# EAGLE design Frequency-Counter-v11 (EAGLE 5.04)
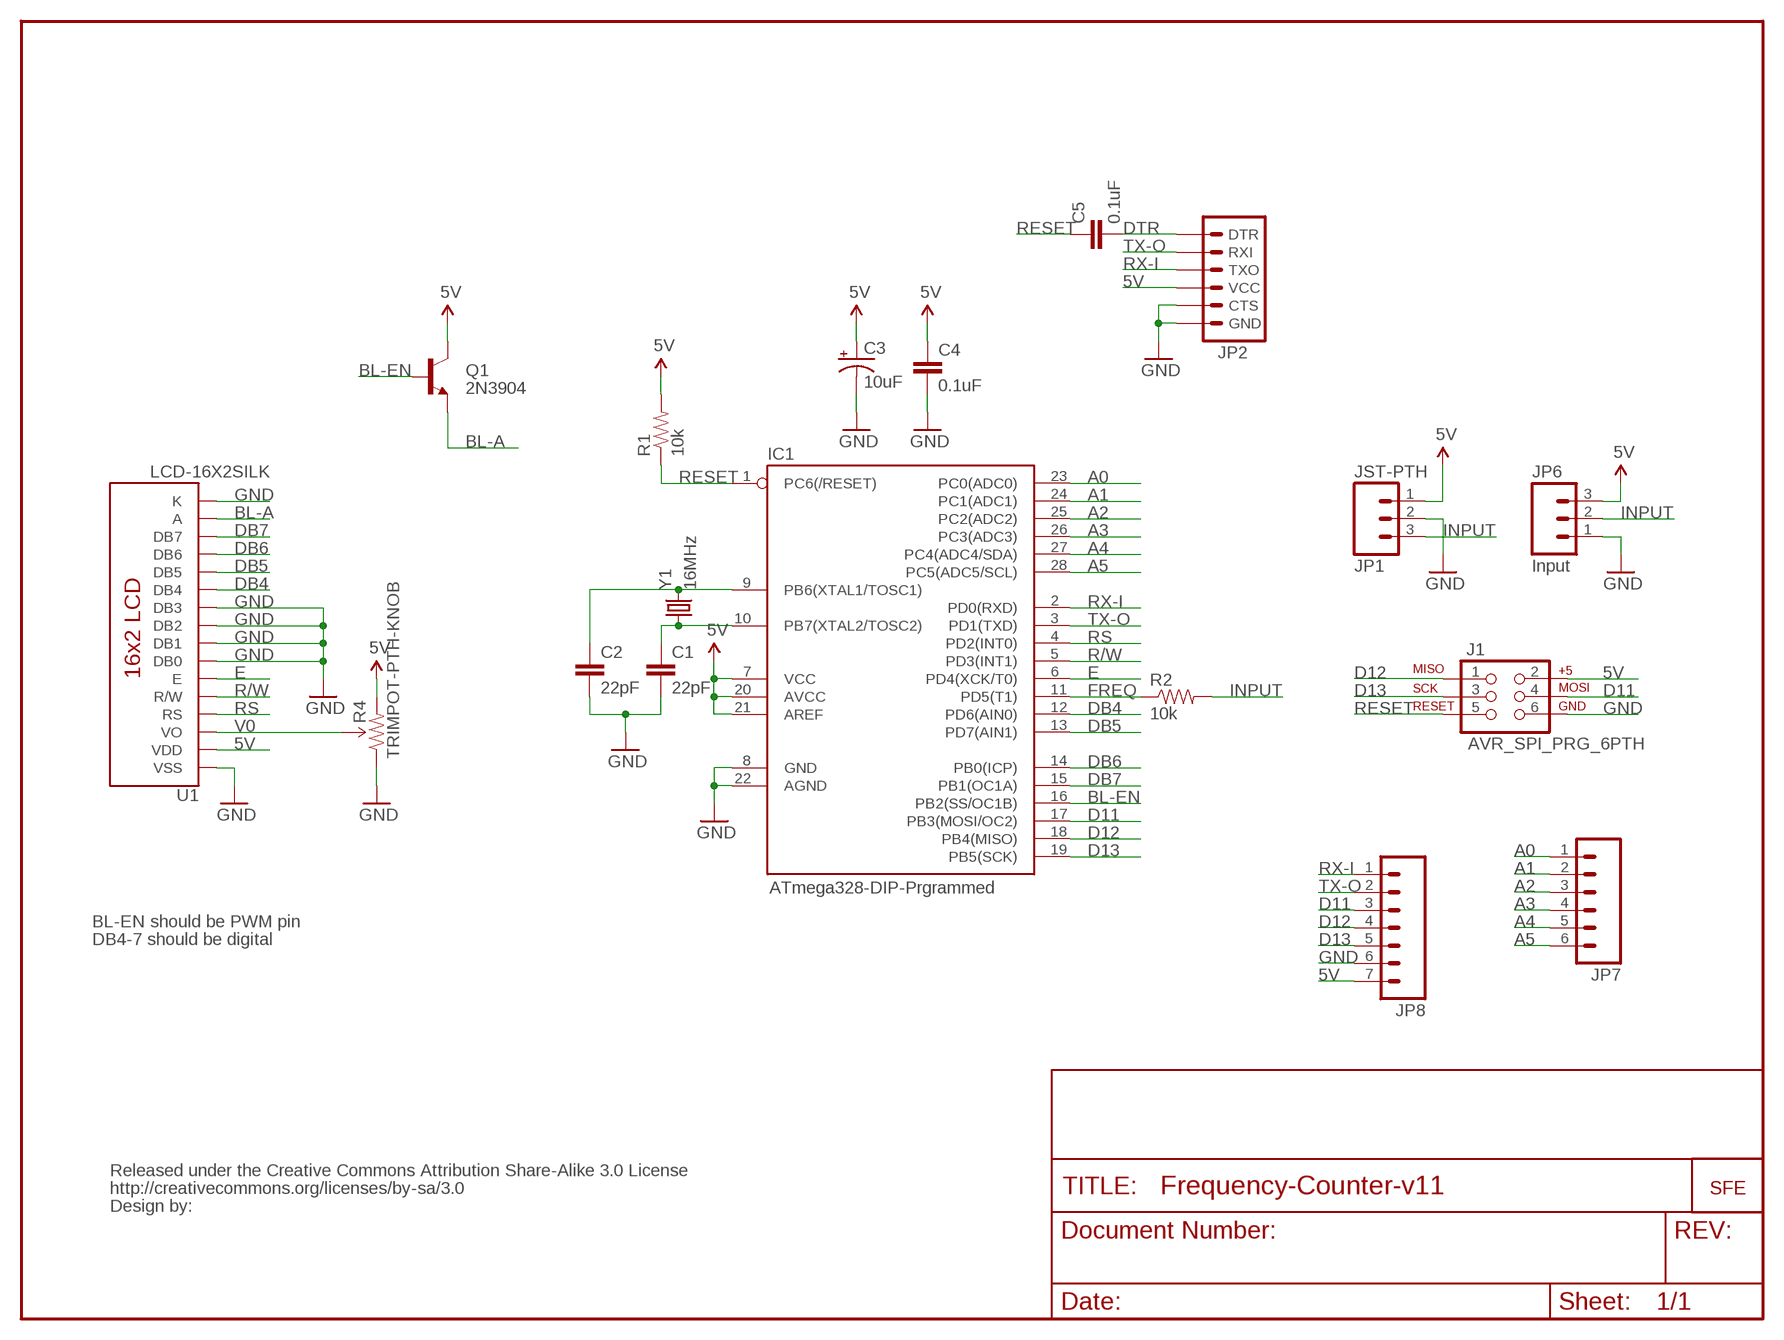
[diagram p0: schematic, sheet 1]

## Parts
C1  22pF  CAPPTH2  [CAP-PTH-SMALL2]
C2  22pF  CAPPTH2  [CAP-PTH-SMALL2]
C3  10uF  CAP_POLPTH2  [CPOL-RADIAL-10UF-25V]
C4  0.1uF  CAPPTH2  [CAP-PTH-SMALL2]
C5  0.1uF  CAPPTH2  [CAP-PTH-SMALL2]
IC1  ATmega328-DIP-Prgrammed  AVR-MEGA8-PPTH  [DIL28-3]
J1  AVR_SPI_PRG_6PTH  [2X3]
JP1  JST-PTH  M03JST-PTH  [JST-3-PTH]
JP2  ARDUINO_SERIAL_PROGRAMPTH  [1X06]
JP3  LOGO-SFENEW  [SFE-NEW-WEBLOGO]
JP6  Input  M03PTH  [1X03]
JP7  M06SIP  [1X06]
JP8  M07  [1X07]
Q1  2N3904  TRANSISTOR_NPNTO92  [TO-92]
R1  10k  RESISTORAXIAL-0.3  [AXIAL-0.3]
R2  10k  RESISTORAXIAL-0.3  [AXIAL-0.3]
R4  TRIMPOT-PTH-KNOB  [3386U]
U1  LCD-16X2SILK  [LCD-16X2]
U$4  CREATIVE_COMMONS  [CREATIVE_COMMONS]
Y1  16MHz  CRYSTALHC49US  [HC49US]

## Nets
5V: C3.1(+) C4.1 IC1.7(VCC) IC1.20(AVCC) IC1.21(AREF) J1.2 JP1.1 JP2.4(VCC) JP6.3 JP8.7 Q1.3(C) R1.P$2 R4.3(CW) U1.2(VDD)
A0: IC1.23(PC0(ADC0)) JP7.1
A1: IC1.24(PC1(ADC1)) JP7.2
A2: IC1.25(PC2(ADC2)) JP7.3
A3: IC1.26(PC3(ADC3)) JP7.4
A4: IC1.27(PC4(ADC4/SDA)) JP7.5
A5: IC1.28(PC5(ADC5/SCL)) JP7.6
BL-A: Q1.1(E) U1.15(A)
BL-EN: IC1.16(PB2(SS/OC1B)) Q1.2(B)
D11: IC1.17(PB3(MOSI/OC2)) J1.4 JP8.3
D12: IC1.18(PB4(MISO)) J1.1 JP8.4
D13: IC1.19(PB5(SCK)) J1.3 JP8.5
DB4: IC1.12(PD6(AIN0)) U1.11(DB4)
DB5: IC1.13(PD7(AIN1)) U1.12(DB5)
DB6: IC1.14(PB0(ICP)) U1.13(DB6)
DB7: IC1.15(PB1(OC1A)) U1.14(DB7)
DTR: C5.2 JP2.1(DTR)
E: IC1.6(PD4(XCK/T0)) U1.6(E)
FREQ: IC1.11(PD5(T1)) R2.P$1
GND: C1.2 C2.2 C3.2(-) C4.2 IC1.8(GND) IC1.22(AGND) J1.6 JP1.2 JP2.5(CTS) JP2.6(GND) JP6.1 JP8.6 R4.1(CCW) U1.1(VSS) U1.7(DB0) U1.8(DB1) U1.9(DB2) U1.10(DB3) U1.16(K)
INPUT: JP1.3 JP6.2 R2.P$2
R/W: IC1.5(PD3(INT1)) U1.5(R/W)
RESET: C5.1 IC1.1(PC6(/RESET)) J1.5 R1.P$1
RS: IC1.4(PD2(INT0)) U1.4(RS)
RX-I: IC1.2(PD0(RXD)) JP2.3(TXO) JP8.1
TX-O: IC1.3(PD1(TXD)) JP2.2(RXI) JP8.2
V0: R4.2(WIPER) U1.3(VO)
XTAL1: C2.1 IC1.9(PB6(XTAL1/TOSC1)) Y1.2
XTAL2: C1.1 IC1.10(PB7(XTAL2/TOSC2)) Y1.1

## Notes on the sheet
- BL-EN should be PWM pin
- DB4-7 should be digital

## Library data of the parts
C1 C2 C4 C5 = SparkFun:CAP: Capacitor Standard 0603 ceramic capacitor, and 0.1" leaded capacitor.
C3 = SparkFun:CAP_POL: Capacitor Polarized These are standard SMD and PTH capacitors. Normally 10uF, 47uF, and 100uF in electrolytic and tantalum varieties. Always verify the external diameter of the through hole cap, it varies with capacity, voltage, and manufacturer. The EIA devices should be standard.
IC1 = SparkFun:AVR-MEGA8-P: MICROCONTROLLER 8 Kbytes FLASH 1 kbytes SRAM 512 bytes EEPROM USART 4-channel 10 bit ADC 2-channel 8 bit ADC
J1 = SparkFun:AVR_SPI_PRG_6: AVR ISP 6 Pin This is the reduced ISP connector for AVR programming. Common on Arduino. This footprint will take up less PCB space and can be used with a 10-pin to 6-pin adapter such as SKU: BOB-08508
JP1 JP6 = SparkFun:M03: Header 3 Standard 3-pin 0.1" header. Use with straight break away headers (SKU : PRT-00116), right angle break away headers (PRT-00553), swiss pins (PRT-00743), machine pins (PRT-00117), and female headers (PRT-00115). Molex polarized connector foot print use with SKU : PRT-08232 with associated crimp pins and housings.
JP2 = SparkFun:ARDUINO_SERIAL_PROGRAM
JP3 = SparkFun:LOGO-SFE: Spark Fun Electronics PCB Logo This is the standard Spark Fun Electronics PCB logo.
JP7 = SparkFun:M06: Header 6 Standard 6-pin 0.1" header. Use with straight break away headers (SKU : PRT-00116), right angle break away headers (PRT-00553), swiss pins (PRT-00743), machine pins (PRT-00117), and female headers (PRT-00115). Molex polarized connector foot print use with SKU : PRT-08094 with associated crimp pins and housings. NOTES ON THE VARIANTS LOCK and LOCK_LONGPADS... This footprint was designed to help hold the alignment of a through-hole component (i.e. 6-pin header) while soldering it into place. You may notice that each hole has been shifted either up or down by 0.005 of an inch from it's more standard position (which is a perfectly straight line). This slight alteration caused the pins (the squares in the middle) to touch the edges of the holes. Because they are alternating, it causes a "brace" to hold the component in place. 0.005 has proven to be the perfect amount of "off-center" position when using our standard breakaway headers. Although looks a little odd when you look at the bare footprint, once you have a header in there, the alteration is very hard to notice. Also, if you push a header all the way into place, it is covered up entirely on the bottom side. This idea of altering the position of holes to aid alignment will be further integrated into the Sparkfun Library for other footprints. It can help hold any component with 3 or more connection pins.
JP8 = SparkFun:M07: Header 7 Standard 7-pin 0.1" header. Use with straight break away headers (SKU : PRT-00116), right angle break away headers (PRT-00553), swiss pins (PRT-00743), machine pins (PRT-00117), and female headers (PRT-00115). NOTES ON THE VARIANTS LOCK and LOCK_LONGPADS... This footprint was designed to help hold the alignment of a through-hole component (i.e. 7-pin header) while soldering it into place. You may notice that each hole has been shifted either up or down by 0.005 of an inch from it's more standard position (which is usually a perfectly straight line). This slight alteration caused the pins (the squares in the middle) to touch the edges of the holes. Because they are alternating, it causes a "brace" to hold the header in place. 0.005 has proven to be the perfect amount of "off-center" position when using our standard breakaway headers. Although looks a little odd when you look at the bare footprint, once you have a header in there, the alteration is very hard to notice. Also, if you push a header all the way into place, it is covered up entirely on the bottom side. This idea of altering the position of holes to aid alignment will be further integrated into the Sparkfun Library for other footprints. It can help hold any component with 3 or more connection pins.
Q1 = SparkFun:TRANSISTOR_NPN: Transistor NPN BJT configuration in SOT23 package. MMBT2222 is the common NPN we use. Double check BCE configuration again layout.
R1 R2 = SparkFun:RESISTOR: Resistor Basic schematic elements and footprints for 0603, 1206, and PTH resistors.
R4 = SparkFun:TRIMPOT
U1 = SparkFun:LCD-16X2
U$4 = SparkFun:CREATIVE_COMMONS
Y1 = SparkFun:CRYSTAL: Crystals Various standard crystals. Proven footprints. Spark Fun Electronics SKU : COM-00534

## Board
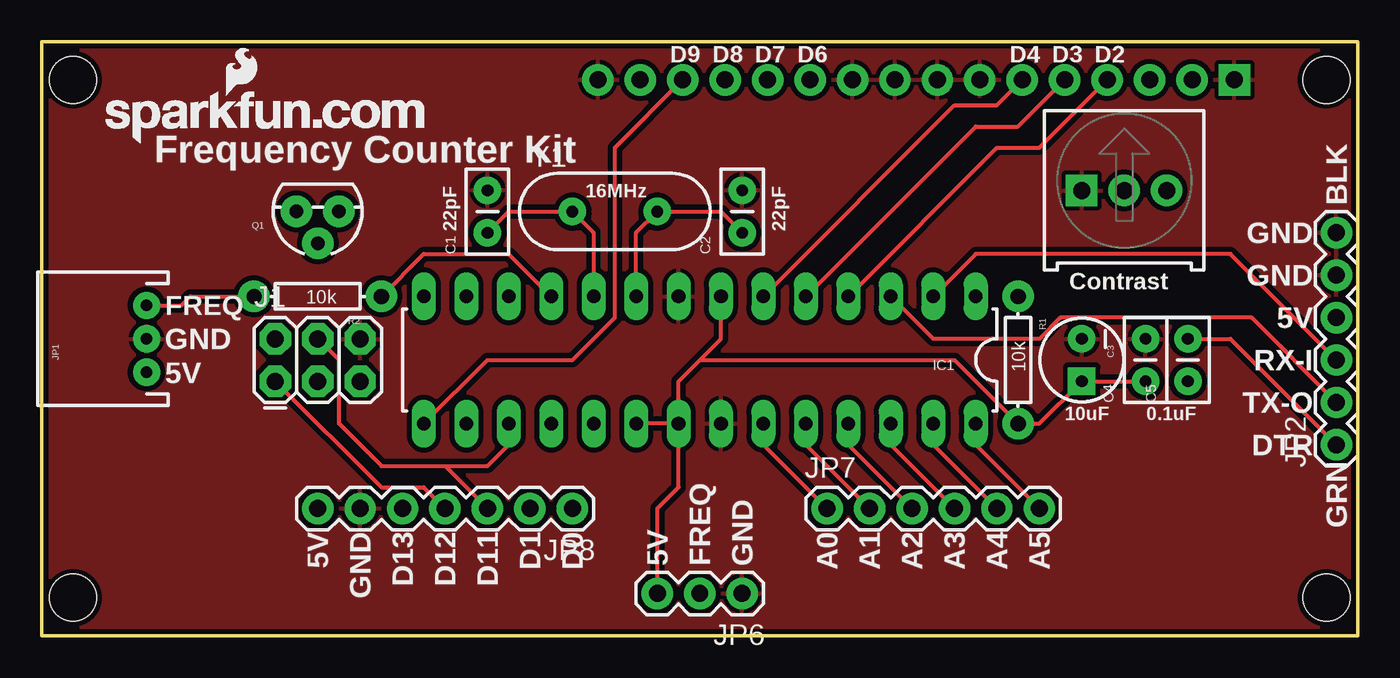
[diagram p1: board, top side]
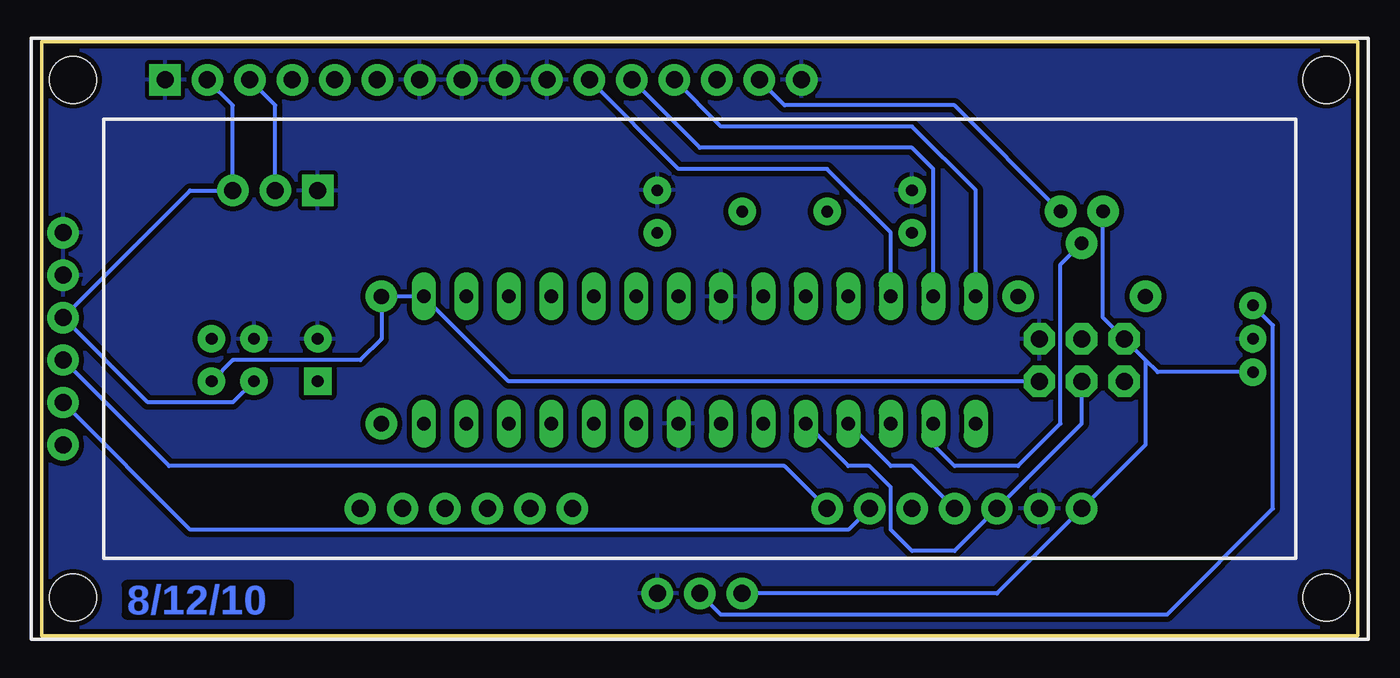
[diagram p2: board, bottom side, seen from below]

Size 78.74 x 35.56 mm. Coordinates in mm from the lower left corner, seen from the top.
Outline: 78.74,0 78.74,35.56 0,35.56 0,0 78.74,0
Copper layers (1*16): Top 0.035mm / dielectric 1.5mm / Bottom 0.035mm
Design rules "SparkFun": minimum track width 8mil, minimum drill 20mil, track to track 8mil, track to pad 8mil, pad to pad 8mil, via to via 8mil, smd to smd 8mil, copper to edge 8mil, drill to drill 8mil, minimum pad ring 12mil, minimum via ring 10mil, stop-mask expansion 4mil, vias tented up to drill 20mil, thermal gap 10mil

### Footprints (pad centres in the part's own frame; a part is rotated, then mirrored left to right if it is on the bottom)
CAP-PTH-SMALL2 = drill 0.7 pad 1.651 round: 1 0,0; 2 2.54,0
CPOL-RADIAL-10UF-25V = drill 0.7 pad 1.651 square: 1 1.27,0 | drill 0.7 pad 1.651 round: 2 -1.27,0
DIL28-3 = drill 0.813 long: 1 -16.51,-3.81; 2 -13.97,-3.81; 3 -11.43,-3.81; 4 -8.89,-3.81; 5 -6.35,-3.81; 6 -3.81,-3.81; 7 -1.27,-3.81; 8 1.27,-3.81; 9 3.81,-3.81; 10 6.35,-3.81; 11 8.89,-3.81; 12 11.43,-3.81; 13 13.97,-3.81; 14 16.51,-3.81; 15 16.51,3.81; 16 13.97,3.81; 17 11.43,3.81; 18 8.89,3.81; 19 6.35,3.81; 20 3.81,3.81; 21 1.27,3.81; 22 -1.27,3.81; 23 -3.81,3.81; 24 -6.35,3.81; 25 -8.89,3.81; 26 -11.43,3.81; 27 -13.97,3.81; 28 -16.51,3.81
2X3 = drill 1.016 pad 1.88 octagon: 1 0,0; 2 0,2.54; 3 2.54,0; 4 2.54,2.54; 5 5.08,0; 6 5.08,2.54
JST-3-PTH = drill 0.7 pad 1.626 round: 1 -2,-5; 2 0,-5; 3 2,-5
1X06 = drill 1.016 pad 1.88 round: 1 0,0; 2 2.54,0; 3 5.08,0; 4 7.62,0; 5 10.16,0; 6 12.7,0
1X03 = drill 1.016 pad 1.88 round: 1 0,0; 2 2.54,0; 3 5.08,0
1X07 = drill 1.016 pad 1.88 round: 1 0,0; 2 2.54,0; 3 5.08,0; 4 7.62,0; 5 10.16,0; 6 12.7,0; 7 15.24,0
TO-92 = drill 0.813 pad 1.88 round: 1 -1.27,0; 2 0,1.905; 3 1.27,0
AXIAL-0.3 = drill 0.9 pad 1.88 round: P$1 -3.81,0; P$2 3.81,0
3386U = drill 1.016 pad 1.88 square: 1 -2.54,-0.015 | drill 1.016 pad 1.88 round: 2 0,-0.015; 3 2.54,-0.015
LCD-16X2 = drill 1.016 pad 1.88 square: 1 -32,15.5 | drill 1.016 pad 1.88 round: 2 -29.46,15.5; 3 -26.92,15.5; 4 -24.38,15.5; 5 -21.84,15.5; 6 -19.3,15.5; 7 -16.76,15.5; 8 -14.22,15.5; 9 -11.68,15.5; 10 -9.14,15.5; 11 -6.6,15.5; 12 -4.06,15.5; 13 -1.52,15.5; 14 1.02,15.5; 15 3.56,15.5; 16 6.1,15.5 | hole 2.8: -37.5,15.5; -37.5,-15.5; 37.5,15.5; 37.5,-15.5
HC49US = drill 0.7 pad 1.651 round: 1 -2.54,0; 2 2.54,0

### Placement (x,y rotation side)
C1  26.67,24.13 90 top
C2  41.91,24.13 90 top
C3  62.23,16.51 270 top
C4  66.04,15.24 90 top
C5  68.58,15.24 90 top
IC1  39.37,16.51 180 top
J1  13.97,15.24 0 top
JP1  1.27,17.78 90 top
JP2  77.47,11.43 90 top
JP3  3.81,29.46 0 top
JP6  41.91,2.54 180 top
JP7  46.99,7.62 0 top
JP8  31.75,7.62 180 top
Q1  16.51,25.4 180 top
R1  58.42,16.51 270 top
R2  16.51,20.32 180 top
R4  64.77,26.67 0 top
U1  39.37,17.78 0 bottom
U$4  20.32,-10.16 0 top  (outside the outline)
Y1  34.29,25.4 0 top

### Tracks (layer width: path | path; a pad name or v marks a point on that pad's centre or on a via)
5V
  Top 0.254: IC1.7 40.64,17.78 39.37,16.51 | 39.37,16.51 38.1,15.24 IC1.21 | IC1.21 IC1.20 | JP6.3 36.83,7.62 38.1,8.89 IC1.21 | C4.1 C3.1 59.69,12.7 R1.P$2 54.61,16.51 39.37,16.51
  Bottom 0.254: U1.2 67.31,31.75 R4.3 69.86,26.66 JP2.4 72.39,13.97 67.31,13.97 C4.1 | 12.7,16.51 J1.2 15.24,19.05 Q1.3 | JP1.1 11.97,15.78 12.7,16.51 | JP6.3 21.59,2.54 JP8.7 12.7,11.43 12.7,16.51
A0
  Top 0.254: IC1.23 43.18,11.43 JP7.1
A1
  Top 0.254: IC1.24 45.72,11.43 JP7.2
A2
  Top 0.254: IC1.25 48.26,11.43 JP7.3
A3
  Top 0.254: IC1.26 50.8,11.43 JP7.4
A4
  Top 0.254: IC1.27 53.34,11.43 JP7.5
A5
  Top 0.254: IC1.28 55.88,11.43 JP7.6
BL-A
  Bottom 0.254: U1.15 34.29,31.75 24.13,31.75 Q1.1
BL-EN
  Bottom 0.254: IC1.16 25.4,11.43 24.13,10.16 20.32,10.16 17.78,12.7 17.78,22.23 Q1.2
D11
  Top 0.254: IC1.17 27.94,11.43 26.67,10.16 25.4,10.16 24.13,10.16 | 24.13,10.16 20.32,10.16 17.78,12.7 17.78,16.51 J1.4 | 24.13,10.16 JP8.3
  Bottom 0.254: IC1.17 27.94,11.43
D12
  Top 0.254: JP8.4 22.86,8.89 20.32,8.89 J1.1
  Bottom 0.254: IC1.18 27.94,10.16 26.67,10.16 JP8.4
D13
  Bottom 0.254: IC1.19 30.48,10.16 29.21,10.16 27.94,8.89 27.94,6.35 26.67,5.08 24.13,5.08 JP8.5 16.51,12.7 J1.3
DB4
  Bottom 0.254: IC1.12 27.94,24.13 31.75,27.94 40.63,27.94 U1.11
DB5
  Bottom 0.254: IC1.13 25.4,27.94 26.67,29.21 39.36,29.21 U1.12
DB6
  Bottom 0.254: IC1.14 22.86,26.67 26.67,30.48 38.09,30.48 U1.13
DB7
  Top 0.254: IC1.15 26.67,16.51 31.75,16.51 34.29,19.05 34.29,29.22 U1.14
DTR
  Top 0.254: C5.2 71.12,17.78 JP2.1
E
  Top 0.254: U1.6 57.14,31.75 54.61,31.75 IC1.6
FREQ
  Top 0.254: IC1.11 27.94,22.86 22.86,22.86 R2.P$1
GND
  pour Bottom (isolate 0.305): 0,35.56 0,0 78.74,0 78.74,35.56
  pour Top (isolate 0.305): 0,35.56 0,0 78.74,0 78.74,35.56
INPUT
  Top 0.254: JP1.3 8.35,19.78 8.89,20.32 R2.P$2
  Bottom 0.254: JP6.2 38.1,1.27 11.43,1.27 5.08,7.62 5.08,18.59 JP1.3
R/W
  Top 0.254: U1.5 58.41,30.48 55.88,30.48 IC1.5
RESET
  Bottom 0.254: J1.5 50.8,15.24 IC1.1 R1.P$1 58.42,17.78 59.69,16.51 67.31,16.51 C5.1
RS
  Top 0.254: U1.4 59.68,29.21 57.15,29.21 IC1.4
RX-I
  Top 0.254: IC1.2 55.88,22.86 71.12,22.86 JP2.3
  Bottom 0.254: JP8.1 34.29,10.16 71.12,10.16 JP2.3
TX-O
  Top 0.254: IC1.3 53.34,17.78 59.69,17.78 60.96,19.05 72.39,19.05 JP2.2
  Bottom 0.254: JP8.2 30.48,6.35 69.85,6.35 JP2.2
V0
  Bottom 0.254: R4.2 64.77,31.76 U1.3
XTAL1
  Top 0.254: IC1.9 35.56,24.13 Y1.2 40.64,25.4 C2.1
XTAL2
  Top 0.254: IC1.10 33.02,24.13 Y1.1 27.94,25.4 C1.1

### Text on the board
Bottom: 8/12/10
tPlace: D9 | D8 | D7 | D6 | D4 | D3 | D2 | Frequency Counter Kit | 22pF | 16MHz | 22pF | BLK | GND | GND | Contrast | 5V | FREQ | GND | RX-I | 5V | TX-O | 10uF | 0.1uF | DTR | 5V | GND | D13 | D12 | D11 | D1 | D0 | A0 | A1 | A2 | A3 | A4 | A5 | GRN | 5V | FREQ | GND